# Altium project USB调压器.PrjPcb
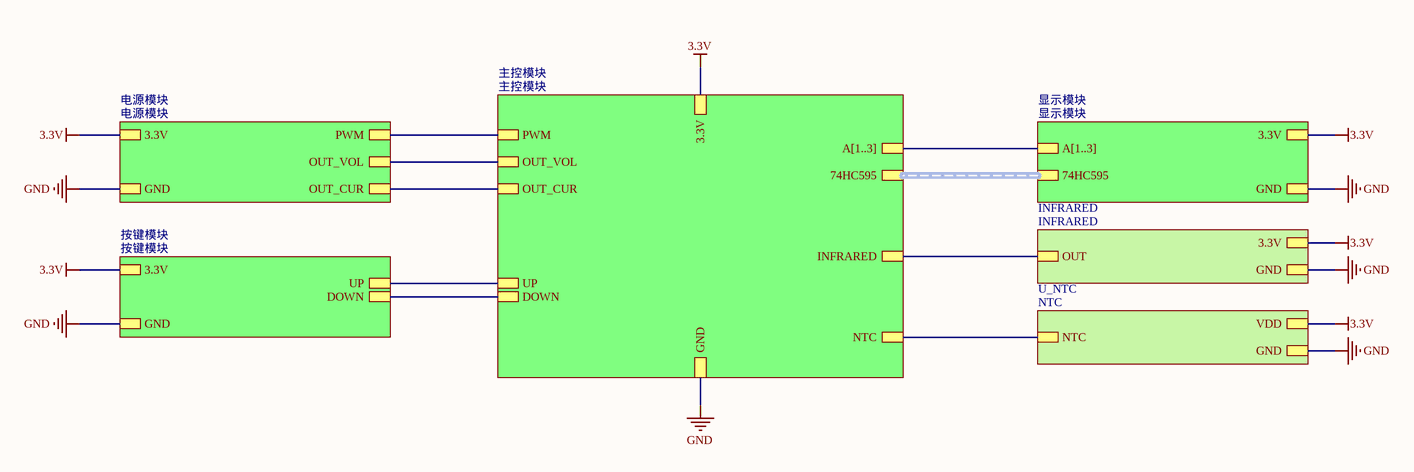
[diagram p0: USB调压器.SchDoc]
5 sheets, 54 parts. Net scope: strictly hierarchical (ports join the sheet entries above them; power ports are local).
Board file: USB调压器.PcbDoc
Sheets:
  USB调压器.SchDoc
    电源模块 = 电源模块.SchDoc
    主控模块 = 主控模块.SchDoc
    显示模块 = 显示模块.SchDoc
    按键模块 = 按键模块.SchDoc

## Sheet USB调压器.SchDoc
size A4; DocumentNumber: 1; SheetNumber: 1; SheetTotal: 8

### Sub-sheets
INFRARED = INFRARED (file not in this document): OUT, 3.3V, GND
U_NTC = NTC (file not in this document): NTC, VDD, GND
主控模块 = 主控模块: A[1..3], 74HC595 (harness 74HC595), INFRARED, PWM, OUT_VOL, OUT_CUR, UP, DOWN, NTC, GND, 3.3V
按键模块 = 按键模块: DOWN, GND, UP, 3.3V
显示模块 = 显示模块: 74HC595 (harness 74HC595), GND, 3.3V, A[1..3]
电源模块 = 电源模块: GND, PWM, 3.3V, OUT_VOL, OUT_CUR

### Nets
3.3V: sheet 电源模块/3.3V, sheet 主控模块/3.3V, sheet 显示模块/3.3V, sheet 按键模块/3.3V, sheet INFRARED/3.3V, sheet U_NTC/VDD
GND: sheet 电源模块/GND, sheet 主控模块/GND, sheet 显示模块/GND, sheet 按键模块/GND, sheet INFRARED/GND, sheet U_NTC/GND
CURRENT: sheet 电源模块/OUT_CUR, sheet 主控模块/OUT_CUR
DOWN: sheet 主控模块/DOWN, sheet 按键模块/DOWN
INFRARED: sheet 主控模块/INFRARED, sheet INFRARED/OUT
NTC: sheet 主控模块/NTC, sheet U_NTC/NTC
PWM: sheet 电源模块/PWM, sheet 主控模块/PWM
UP: sheet 主控模块/UP, sheet 按键模块/UP
VOLATAGE: sheet 电源模块/OUT_VOL, sheet 主控模块/OUT_VOL

### Buses and harness runs
bus sheet 主控模块/A[1..3] = sheet 显示模块/A[1..3]
harness sheet 主控模块/74HC595 = sheet 显示模块/74HC595

## Sheet 电源模块.SchDoc
size A4; DocumentNumber: 2; SheetNumber: 2; SheetTotal: 8
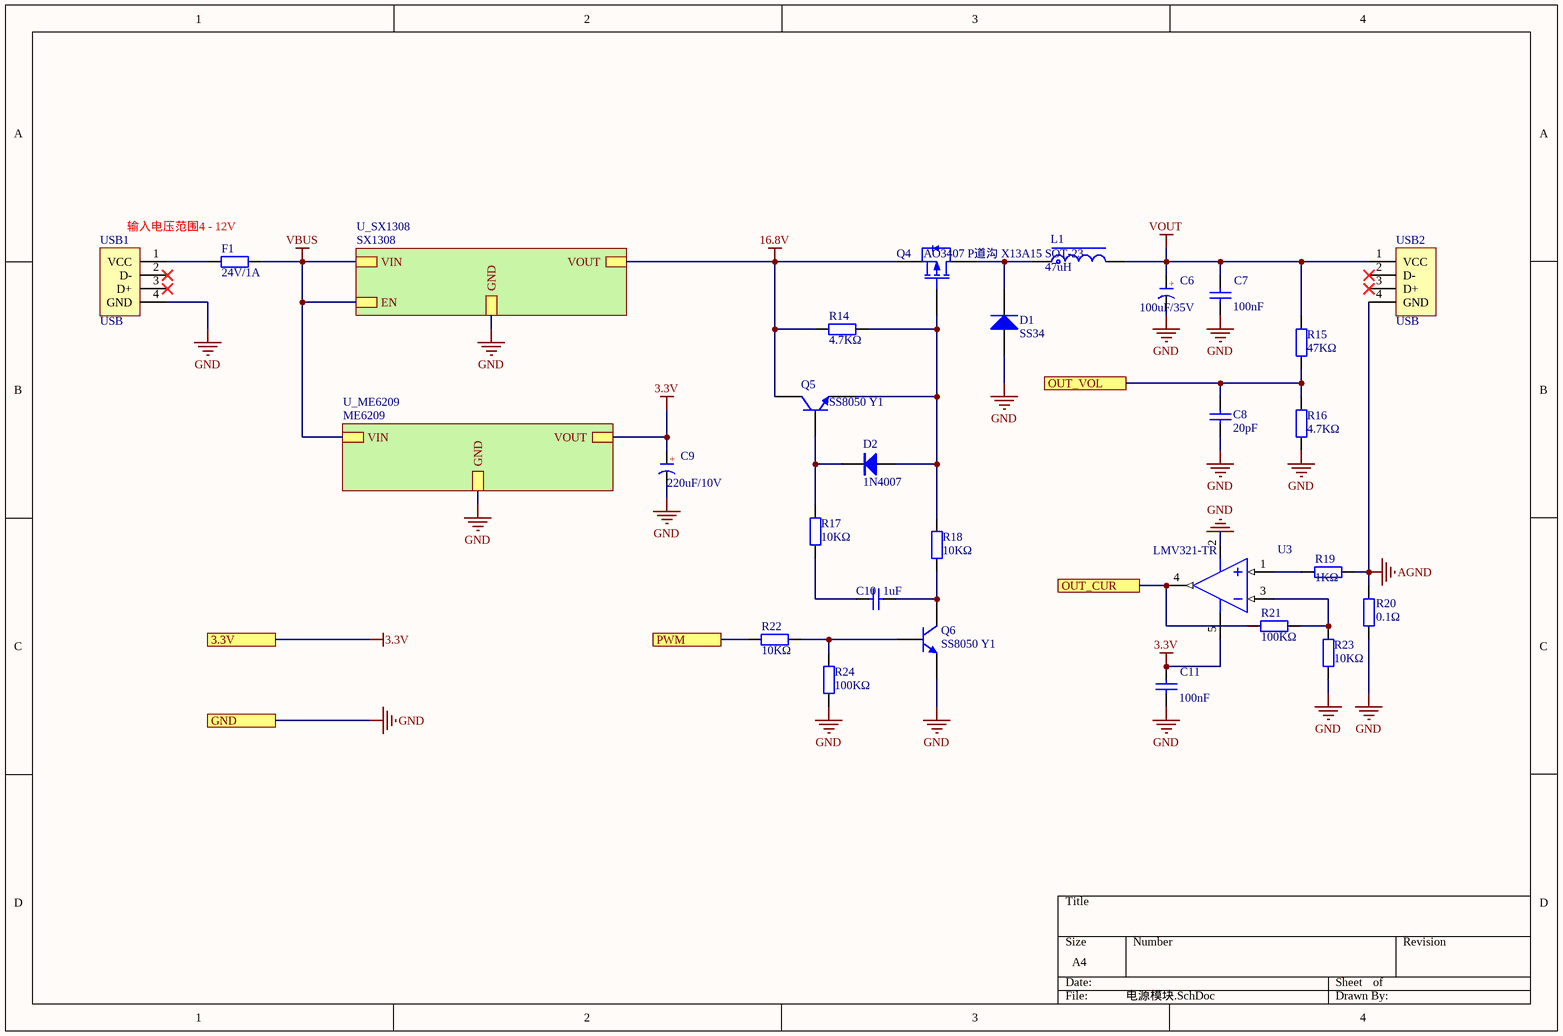
[diagram p1: 电源模块.SchDoc]

### Parts
C6  100uF/35V  [CAP 2.5*6.3*11.2-H]
C7  100nF  [LC-0603_C]
C8  20pF  [LC-0603_C]
C9  220uF/10V  [CAP 2.0*5*11-H]
C10  1uF  [LC-0603_C]
C11  100nF  [LC-0603_C]
D1  SS34  [LC-SMA(DO-214AC)_S1]
D2  1N4007  [SOD-323]
F1  value 24V/1A  [1206]  (hidden comment: MF-NSMF020-2 0.2A 24V)
L1  47uH  [CDRH73]
Q4  AO3407 P道沟 X13A15 SOT-23  [LC-SOT-23(SOT-23-3)]
Q5  SS8050 Y1  [LC-SOT-23(SOT-23-3)]
Q6  SS8050 Y1  [LC-SOT-23(SOT-23-3)]
R14  4.7KΩ  [LC-0603_R]
R15  47KΩ  [LC-0603_R]
R16  4.7KΩ  [LC-0603_R]
R17  10KΩ  [LC-0603_R]
R18  10KΩ  [LC-0603_R]
R19  1KΩ  [LC-0603_R]
R20  0.1Ω  [R 2512_L]
R21  100KΩ  [LC-0603_R]
R22  10KΩ  [LC-0603_R]
R23  10KΩ  [LC-0603_R]
R24  100KΩ  [LC-0603_R]
U3  LMV321-TR  [LC-SOT-23-5]
USB1  USB  [USB_A/P_A]
USB2  USB  [USB-A/S_A]

### Sub-sheets
U_ME6209 = ME6209 (file not in this document): VOUT, VIN, GND
U_SX1308 = SX1308 (file not in this document): VIN, EN, GND, VOUT

### Ports
3.3V, GND, OUT_CUR, OUT_VOL, PWM

### Nets
3.3V: C9.1(A) C11.2 U3.5(V+) ; port 3.3V, sheet U_ME6209/VOUT
16.8V: Q4.2(S) Q5.3(C) R14.2 ; sheet U_SX1308/VOUT
AGND: R19.1 R20.2 USB2.4(GND)
GND: C6.2(K) C7.1 C8.1 C9.2(K) C11.1 D1.1(A) Q6.2(E) R16.1 R20.1 R23.2 R24.2 U3.2(V-) USB1.4(GND) ; port GND, sheet U_SX1308/GND, sheet U_ME6209/GND
VBUS: F1.2 ; sheet U_SX1308/VIN, sheet U_SX1308/EN, sheet U_ME6209/VIN
VOUT: C6.1(A) C7.2 L1.2 R15.2 USB2.1(VCC)
CURRENT: R21.2 U3.4(OUT) ; port OUT_CUR
PWM: R22.2 ; port PWM
VOLATAGE: C8.2 R15.1 R16.2 ; port OUT_VOL
NetC10_1: C10.1 R17.1
NetC10_2: C10.2 Q6.3(C) R18.1
NetD1_2: D1.2(K) L1.1 Q4.3(D)
NetD2_1: D2.1(A) Q4.1(G) Q5.2(E) R14.1 R18.2
NetD2_2: D2.2(K) Q5.1(B) R17.2
NetF1_1: F1.1 USB1.1(VCC)
NetQ6_1: Q6.1(B) R22.1 R24.1
NetR19_2: R19.2 U3.1(IN+)
NetR21_1: R21.1 R23.1 U3.3(IN-)

Not connected (* = marked no-connect by the designer): USB1 2(D-)* 3(D+)*; USB2 2(D-)* 3(D+)*

### Notes on the sheet
- 输入电压范围4 - 12V
- (in symbol CE) +

### Library data of the parts
C6 C9 = CE: 直插电解电容; 淘宝ID: 封装库来自淘宝 ID：黄晶宝石; BOM名称: 直插电解电容; 联系售后: https://shop463601444.taobao.com
C7 C11 = 0603 100nF (104) 10% 50V: 贴片电容; ComponentLink1Description: 供应商链接; ComponentLink1URL: http://www.szlcsc.com/product/details_15331.html; Package: 0603; Supplier: LC; SuppliersPartNumber: C14663
C8 = 0603 20pF (200) 5% 50V: 贴片电容; ComponentLink1Description: 供应商链接; ComponentLink1URL: http://www.szlcsc.com/product/details_2000.html; Package: 0603; Supplier: LC; SuppliersPartNumber: C1648
C10 = 0603 1uF (105) 10% 50V: 贴片电容; ComponentLink1Description: 供应商链接; ComponentLink1URL: http://www.szlcsc.com/product/details_16531.html; Package: 0603; Supplier: LC; SuppliersPartNumber: C15849
D1 = SMA(DO-214AC) SS54: 二极管; ComponentLink1Description: 供应商链接; ComponentLink1URL: http://www.szlcsc.com/product/details_23178.html; Package: SMA(DO-214AC); Supplier: LC; SuppliersPartNumber: C22452
D2 = 1N4148: 开关二极管; BOM名称: 高速开关二极管; 淘宝ID: 封装库来自淘宝 ID：黄晶宝石; 欢迎光临: https://shop463601444.taobao.com
F1 = MF-NSMF020-2 0.2A 24V: 自恢复保险丝; Published: 8-Jun-2000; LatestRevisionDate: 17-Jul-2002; LatestRevisionNote: Re-released for DXP Platform.; PackageReference: AXIAL-0.4; Publisher: Altium Limited
L1 = L-CDRH: 功率屏蔽电感; 版权归属: 封装库来自淘宝 ID：黄晶宝石; BOM名称: 功率屏蔽电感; 联系售后: https://shop463601444.taobao.com
Q4 = AO3401A P道沟 X13A15 SOT-23: MOS(场效应管); ComponentLink1Description: 供应商链接; ComponentLink1URL: http://www.szlcsc.com/product/details_15801.html; Package: SOT-23; Supplier: LC; SuppliersPartNumber: C15127
Q5 Q6 = SOT-23 SS8050 Y1: 三极管; ComponentLink1Description: 供应商链接; ComponentLink1URL: http://www.szlcsc.com/product/details_2507.html; Package: SOT-23; Supplier: LC; SuppliersPartNumber: C2150
R14 = 0603 4.7KΩ (4701) 1%: 贴片电阻; ComponentLink1Description: 供应商链接; ComponentLink1URL: http://www.szlcsc.com/product/details_23889.html; Package: 0603; Supplier: LC; SuppliersPartNumber: C23162
R15 R21 R24 = 0603 100KΩ (1003) 1%: 贴片电阻; ComponentLink1Description: 供应商链接; ComponentLink1URL: http://www.szlcsc.com/product/details_26546.html; Package: 0603; Supplier: LC; SuppliersPartNumber: C25803
R16-R18 R22 R23 = 0603 10KΩ (1002) 1%: 贴片电阻; ComponentLink1Description: 供应商链接; ComponentLink1URL: http://www.szlcsc.com/product/details_26547.html; Package: 0603; Supplier: LC; SuppliersPartNumber: C25804
R19 = 0603 1KΩ (1001) 1%: 贴片电阻; ComponentLink1Description: 供应商链接; ComponentLink1URL: http://www.szlcsc.com/product/details_21904.html; Package: 0603; Supplier: LC; SuppliersPartNumber: C21190
R20 = R: 贴片电阻; 版权归属: 来自淘宝 ID：黄晶宝石; 封装库来自淘宝卖家 ID：黄晶宝石: 其他店铺购入均为盗版，不享受售后技术支持服务，请立即申请退款; BOM名称: 贴片电阻; 联系售后: https://shop463601444.taobao.com
U3 = LMV321IDBVRG4: 运放; ComponentLink1Description: 供应商链接; ComponentLink1URL: http://www.szlcsc.com/product/details_8449.html; Package: SOT-23-5; Supplier: LC; SuppliersPartNumber: C7972
USB1 = USB-A/P: USB-A型公接口; 版权归属: 封装库来自淘宝卖家 ID：黄晶宝石; BOM名称: USB-A型公接口; 学习资源: https://shop463601444.taobao.com
USB2 = USB-A/S: USB-A型母接口; 版权归属: 封装库来自淘宝 ID：黄晶宝石; BOM名称: USB-A型母接口; 学习资源: https://shop463601444.taobao.com

## Sheet 主控模块.SchDoc
size A4; DocumentNumber: 3; SheetNumber: 3; SheetTotal: 8
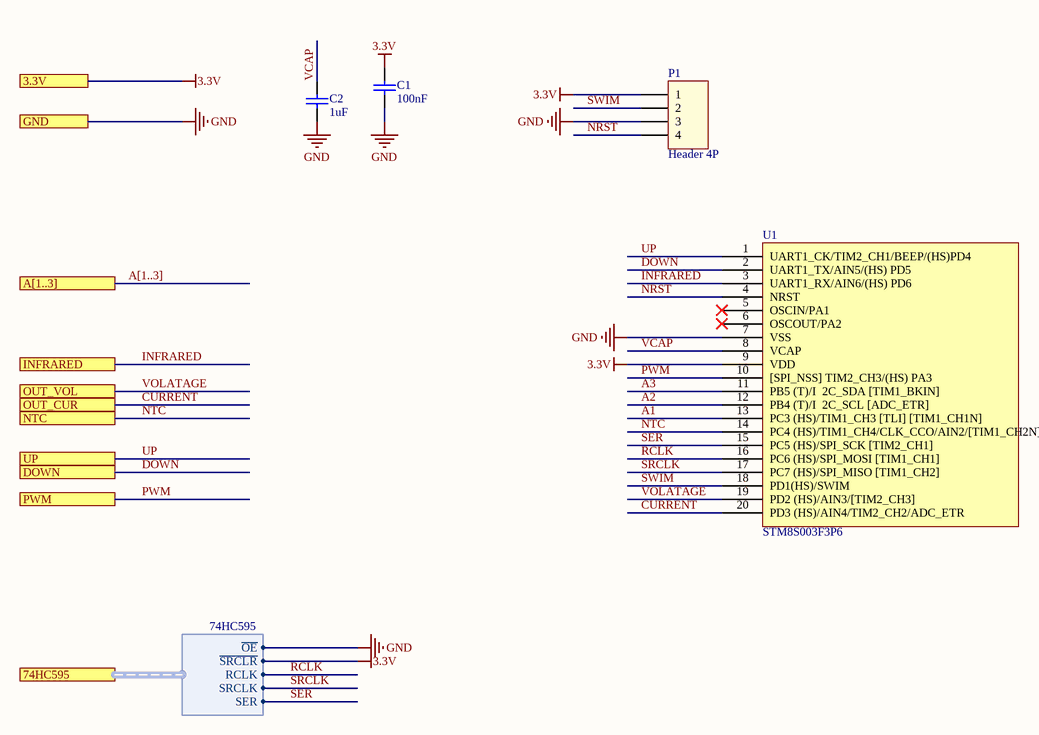
[diagram p2: 主控模块.SchDoc]

### Parts
C1  100nF  [LC-0603_C]
C2  1uF  [LC-0603_C]
P1  Header 4P  [2.54mm_4P]
U1  STM8S003F3P6  [LC-TSSOP-20]

### Ports
3.3V, 74HC595 (harness 74HC595), A[1..3], DOWN, GND, INFRARED, NTC, OUT_CUR, OUT_VOL, PWM, UP

### Harnesses
74HC595: ~{OE}, RCLK, ~{SRCLR}, SRCLK, SER

### Nets
3.3V: C1.2 P1.1 U1.9(VDD) ; port 3.3V, port 74HC595.~{SRCLR}
GND: C1.1 C2.1 P1.3 U1.7(VSS) ; port GND, port 74HC595.~{OE}
A1: U1.13(PC3_(HS)/TIM1_CH3_[TLI]_[TIM1_CH1N])
A2: U1.12(PB4_(T)/I__2C_SCL_[ADC_ETR])
A3: U1.11(PB5_(T)/I__2C_SDA_[TIM1_BKIN])
CURRENT: U1.20(PD3_(HS)/AIN4/TIM2_CH2/ADC_ETR) ; port OUT_CUR
DOWN: U1.2(UART1_TX/AIN5/(HS)_PD5) ; port DOWN
INFRARED: U1.3(UART1_RX/AIN6/(HS)_PD6) ; port INFRARED
NRST: P1.4 U1.4(NRST)
NTC: U1.14(PC4_(HS)/TIM1_CH4/CLK_CCO/AIN2/[TIM1_CH2N]) ; port NTC
PWM: U1.10([SPI_NSS]_TIM2_CH3/(HS)_PA3) ; port PWM
RCLK: U1.16(PC6_(HS)/SPI_MOSI_[TIM1_CH1]) ; port 74HC595.RCLK
SER: U1.15(PC5_(HS)/SPI_SCK_[TIM2_CH1]) ; port 74HC595.SER
SRCLK: U1.17(PC7_(HS)/SPI_MISO_[TIM1_CH2]) ; port 74HC595.SRCLK
SWIM: P1.2 U1.18(PD1(HS)/SWIM)
UP: U1.1(UART1_CK/TIM2_CH1/BEEP/(HS)PD4) ; port UP
VCAP: C2.2 U1.8(VCAP)
VOLATAGE: U1.19(PD2_(HS)/AIN3/[TIM2_CH3]) ; port OUT_VOL

Not connected (* = marked no-connect by the designer): U1 5(OSCIN/PA1)* 6(OSCOUT/PA2)*

### Buses and harness runs
bus A[1..3] = port A[1..3]

### Library data of the parts
C1 = 0603 100nF (104) 10% 50V: 贴片电容; ComponentLink1Description: 供应商链接; ComponentLink1URL: http://www.szlcsc.com/product/details_15331.html; Package: 0603; Supplier: LC; SuppliersPartNumber: C14663
C2 = 0603 1uF (105) 10% 50V: 贴片电容; ComponentLink1Description: 供应商链接; ComponentLink1URL: http://www.szlcsc.com/product/details_16531.html; Package: 0603; Supplier: LC; SuppliersPartNumber: C15849
U1 = STM8S003F3P6: MCU; ComponentLink1Description: 供应商链接; ComponentLink1URL: http://www.szlcsc.com/product/details_19317.html; Package: TSSOP-20; Supplier: LC; SuppliersPartNumber: C18615

## Sheet 显示模块.SchDoc
size A4; DocumentNumber: 4; SheetNumber: 4; SheetTotal: 8
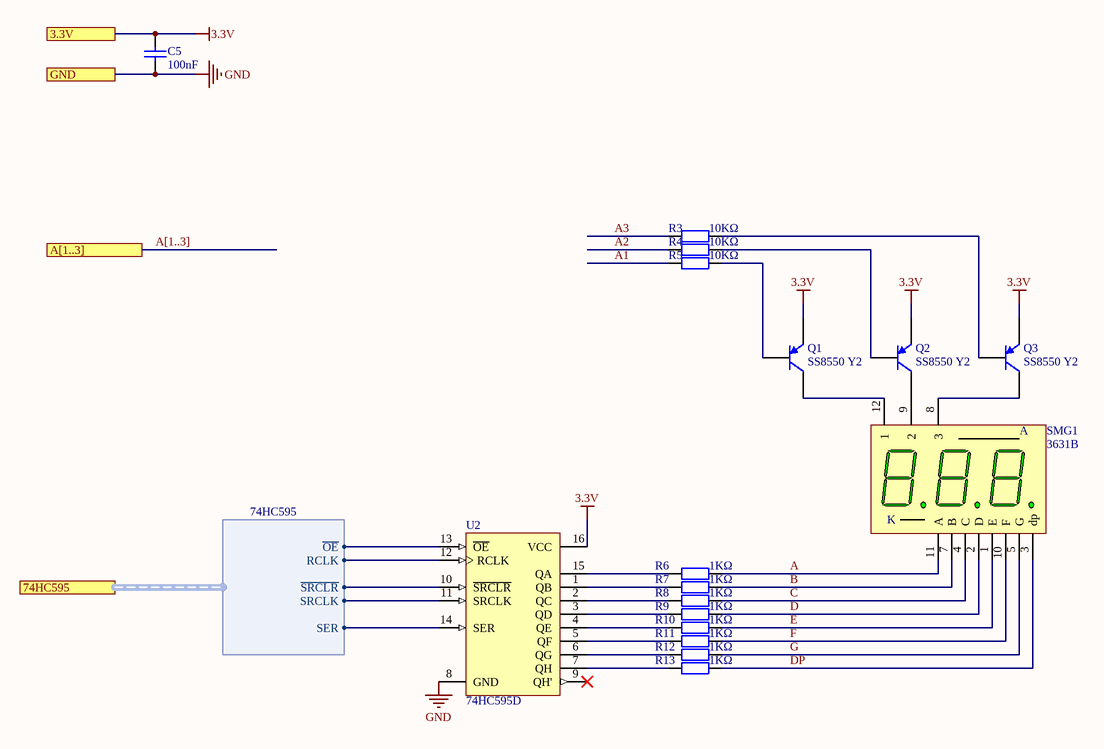
[diagram p3: 显示模块.SchDoc]

### Parts
C5  100nF  [LC-0603_C]
Q1  SS8550 Y2  [LC-SOT-23(SOT-23-3)]
Q2  SS8550 Y2  [LC-SOT-23(SOT-23-3)]
Q3  SS8550 Y2  [LC-SOT-23(SOT-23-3)]
R3  10KΩ  [LC-0603_R]
R4  10KΩ  [LC-0603_R]
R5  10KΩ  [LC-0603_R]
R6  1KΩ  [LC-0603_R]
R7  1KΩ  [LC-0603_R]
R8  1KΩ  [LC-0603_R]
R9  1KΩ  [LC-0603_R]
R10  1KΩ  [LC-0603_R]
R11  1KΩ  [LC-0603_R]
R12  1KΩ  [LC-0603_R]
R13  1KΩ  [LC-0603_R]
SMG1  3631B  [SMG 0.36-3P]
U2  74HC595D  [LC-SOIC-16_150mil]

### Ports
3.3V, 74HC595 (harness 74HC595), A[1..3], GND

### Harnesses
74HC595: ~{OE}, RCLK, ~{SRCLR}, SRCLK, SER

### Nets
3.3V: C5.1 Q1.2(E) Q2.2(E) Q3.2(E) U2.10(~{SRCLR}) U2.16(VCC) ; port 3.3V, port 74HC595.~{SRCLR}
GND: C5.2 U2.8(GND) U2.13(~{OE}) ; port GND, port 74HC595.~{OE}
A: R6.2 SMG1.11(A)
A1: R5.1
A2: R4.1
A3: R3.1
B: R7.2 SMG1.7(B)
C: R8.2 SMG1.4(C)
D: R9.2 SMG1.2(D)
DP: R13.2 SMG1.3(dp)
E: R10.2 SMG1.1(E)
F: R11.2 SMG1.10(F)
G: R12.2 SMG1.5(G)
RCLK: U2.12(RCLK) ; port 74HC595.RCLK
SER: U2.14(SER) ; port 74HC595.SER
SRCLK: U2.11(SRCLK) ; port 74HC595.SRCLK
NetQ1_1: Q1.1(B) R5.2
NetQ1_3: Q1.3(C) SMG1.12(1)
NetQ2_1: Q2.1(B) R4.2
NetQ2_3: Q2.3(C) SMG1.9(2)
NetQ3_1: Q3.1(B) R3.2
NetQ3_3: Q3.3(C) SMG1.8(3)
NetR6_1: R6.1 U2.15(QA)
NetR7_1: R7.1 U2.1(QB)
NetR8_1: R8.1 U2.2(QC)
NetR9_1: R9.1 U2.3(QD)
NetR10_1: R10.1 U2.4(QE)
NetR11_1: R11.1 U2.5(QF)
NetR12_1: R12.1 U2.6(QG)
NetR13_1: R13.1 U2.7(QH)

Not connected (* = marked no-connect by the designer): U2 9(QH')*

### Buses and harness runs
bus A[1..3] = port A[1..3]

### Notes on the sheet
- (in symbol 3631B) K

### Library data of the parts
C5 = 0603 100nF (104) 10% 50V: 贴片电容; ComponentLink1Description: 供应商链接; ComponentLink1URL: http://www.szlcsc.com/product/details_15331.html; Package: 0603; Supplier: LC; SuppliersPartNumber: C14663
Q1-Q3 = SOT-23 SS8550 Y2: 三极管; ComponentLink1Description: 供应商链接; ComponentLink1URL: http://www.szlcsc.com/product/details_9037.html; Package: SOT-23; Supplier: LC; SuppliersPartNumber: C8542
R3-R5 = 0603 10KΩ (1002) 1%: 贴片电阻; ComponentLink1Description: 供应商链接; ComponentLink1URL: http://www.szlcsc.com/product/details_26547.html; Package: 0603; Supplier: LC; SuppliersPartNumber: C25804
R6-R13 = 0603 1KΩ (1001) 1%: 贴片电阻; ComponentLink1Description: 供应商链接; ComponentLink1URL: http://www.szlcsc.com/product/details_21904.html; Package: 0603; Supplier: LC; SuppliersPartNumber: C21190
SMG1 = 3631B: 0.36寸3位共阳数码管; 版权归属: 封装库来自淘宝 ID：黄晶宝石; BOM名称: 0.36寸3位共阳; 学习资源: https://shop463601444.taobao.com
U2 = 74HC595D: 74系列逻辑芯片; ComponentLink1Description: 供应商链接; ComponentLink1URL: http://www.szlcsc.com/product/details_6413.html; Package: SOIC-16_150mil; Supplier: LC; SuppliersPartNumber: C5947

## Sheet 按键模块.SchDoc
size A4; DocumentNumber: 5; SheetNumber: 5; SheetTotal: 8
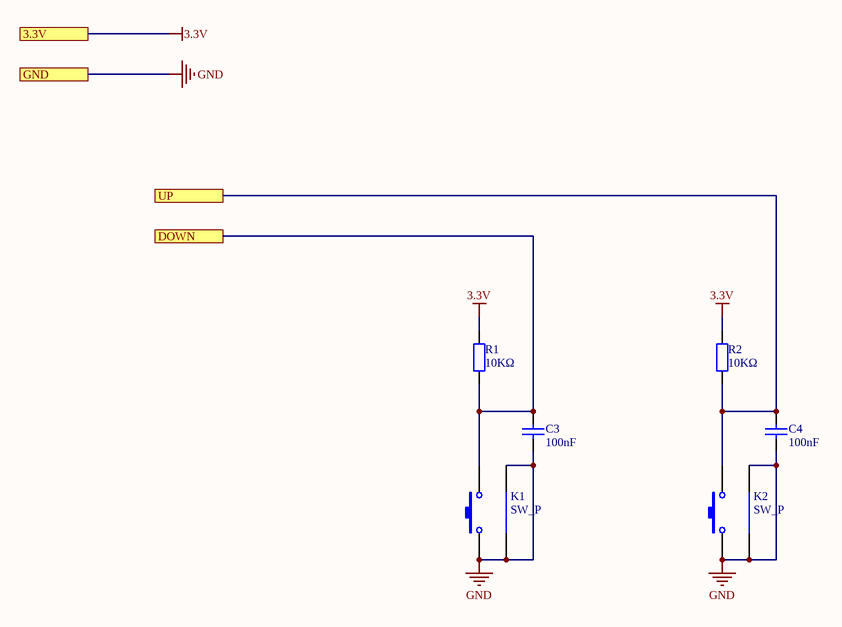
[diagram p4: 按键模块.SchDoc]

### Parts
C3  100nF  [LC-0603_C]
C4  100nF  [LC-0603_C]
K1  SW_P  [KEY-TH_K2-1112SA-AXXW-XX]
K2  SW_P  [KEY-TH_K2-1112SA-AXXW-XX]
R1  10KΩ  [LC-0603_R]
R2  10KΩ  [LC-0603_R]

### Ports
3.3V, DOWN, GND, UP

### Nets
3.3V: R1.2 R2.2 ; port 3.3V
GND: C3.1 C4.1 K1.1 K1.3 K1.4 K2.1 K2.3 K2.4 ; port GND
DOWN: C3.2 K1.2 R1.1 ; port DOWN
UP: C4.2 K2.2 R2.1 ; port UP

### Library data of the parts
C3 C4 = 0603 100nF (104) 10% 50V: 贴片电容; ComponentLink1Description: 供应商链接; ComponentLink1URL: http://www.szlcsc.com/product/details_15331.html; Package: 0603; Supplier: LC; SuppliersPartNumber: C14663
K1 K2 = SW_P: 轻触开关侧
R1 R2 = 0603 10KΩ (1002) 1%: 贴片电阻; ComponentLink1Description: 供应商链接; ComponentLink1URL: http://www.szlcsc.com/product/details_26547.html; Package: 0603; Supplier: LC; SuppliersPartNumber: C25804

## Nets that join several sheets
3.3V: 电源模块 (C9.1 C11.2 U3.5), 主控模块 (C1.2 P1.1 U1.9), 显示模块 (6 pins), 按键模块 (R1.2 R2.2)
GND: 电源模块 (13 pins), 主控模块 (C1.1 C2.1 P1.3 U1.7), 显示模块 (C5.2 U2.8 U2.13), 按键模块 (8 pins)
A1: 主控模块 (U1.13), 显示模块 (R5.1)
A2: 主控模块 (U1.12), 显示模块 (R4.1)
A3: 主控模块 (U1.11), 显示模块 (R3.1)
CURRENT: 电源模块 (R21.2 U3.4), 主控模块 (U1.20)
DOWN: 主控模块 (U1.2), 按键模块 (C3.2 K1.2 R1.1)
PWM: 电源模块 (R22.2), 主控模块 (U1.10)
RCLK: 主控模块 (U1.16), 显示模块 (U2.12)
SER: 主控模块 (U1.15), 显示模块 (U2.14)
SRCLK: 主控模块 (U1.17), 显示模块 (U2.11)
UP: 主控模块 (U1.1), 按键模块 (C4.2 K2.2 R2.1)
VOLATAGE: 电源模块 (C8.2 R15.1 R16.2), 主控模块 (U1.19)